# EAGLE design LEDs (EAGLE 7.7.0)
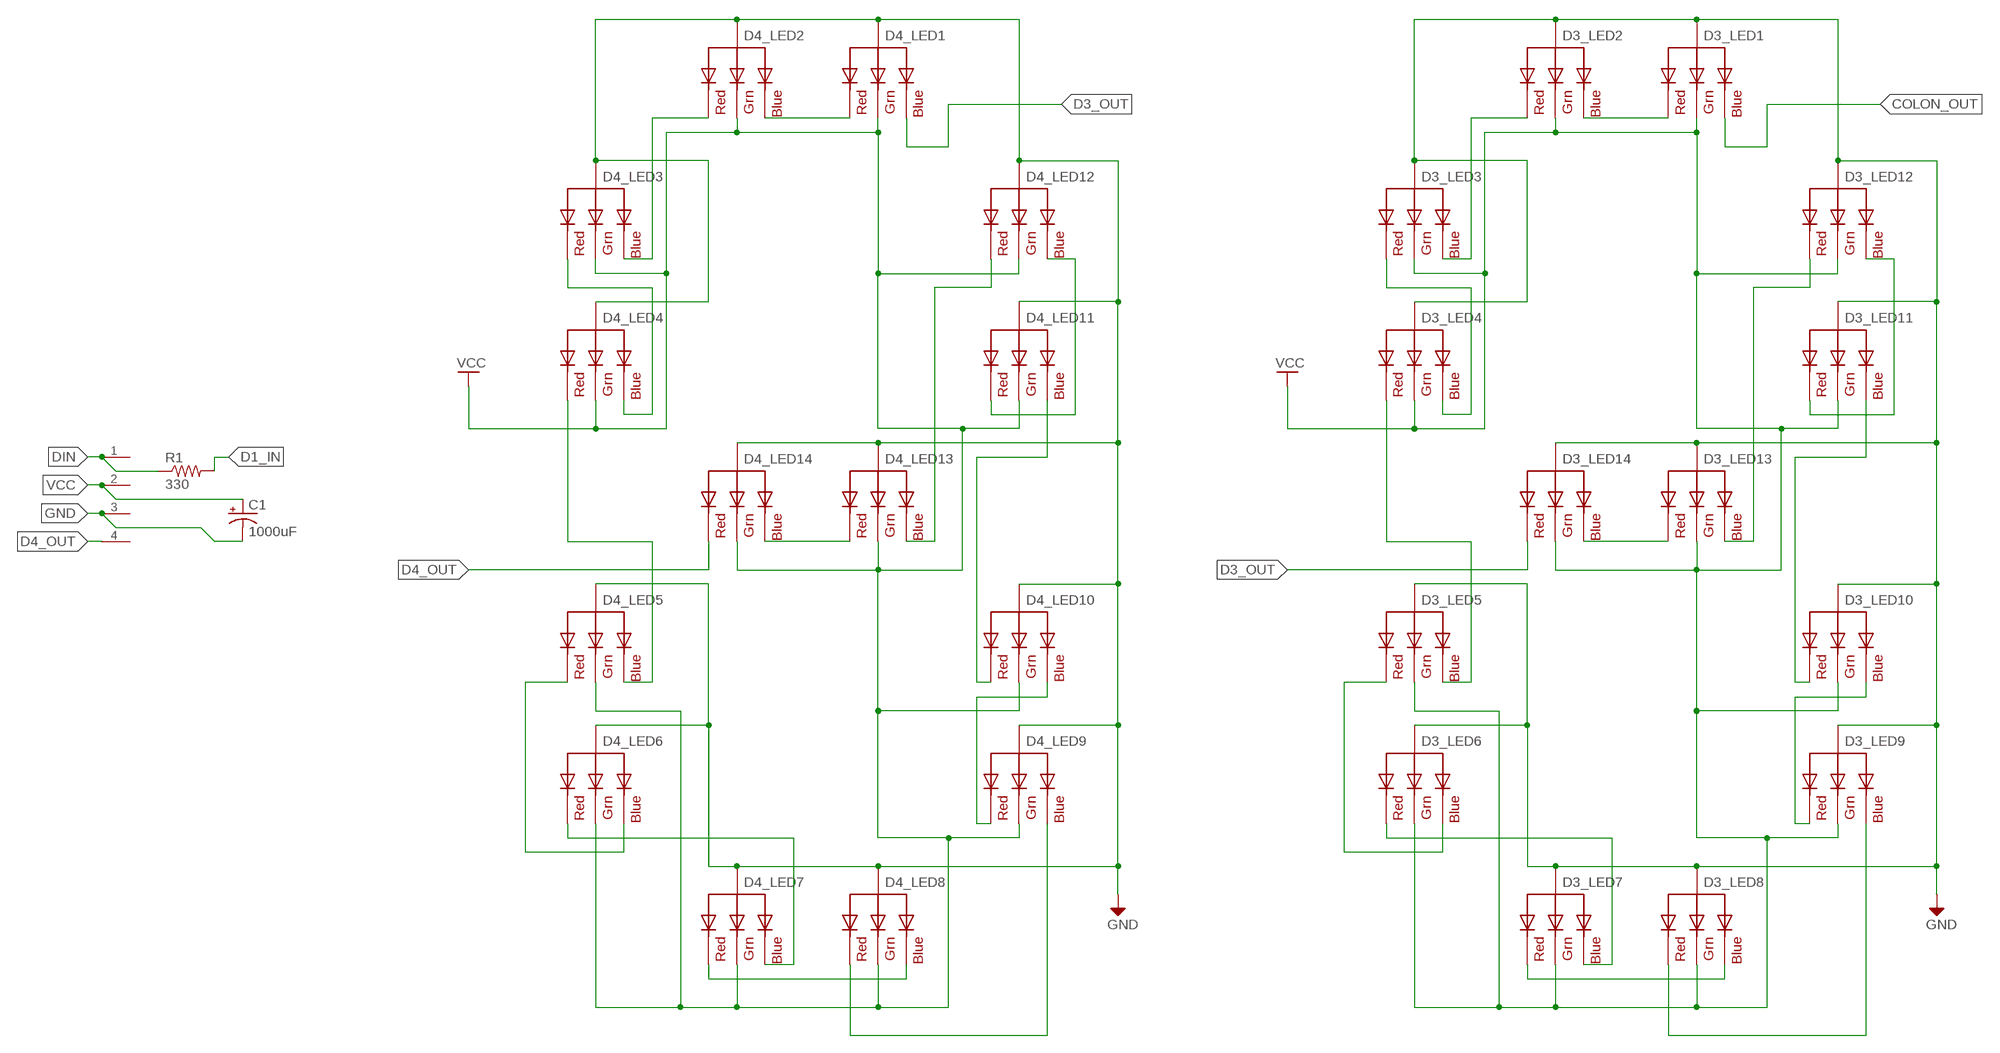
[diagram p0: schematic, sheet 1, part 1 of 2]
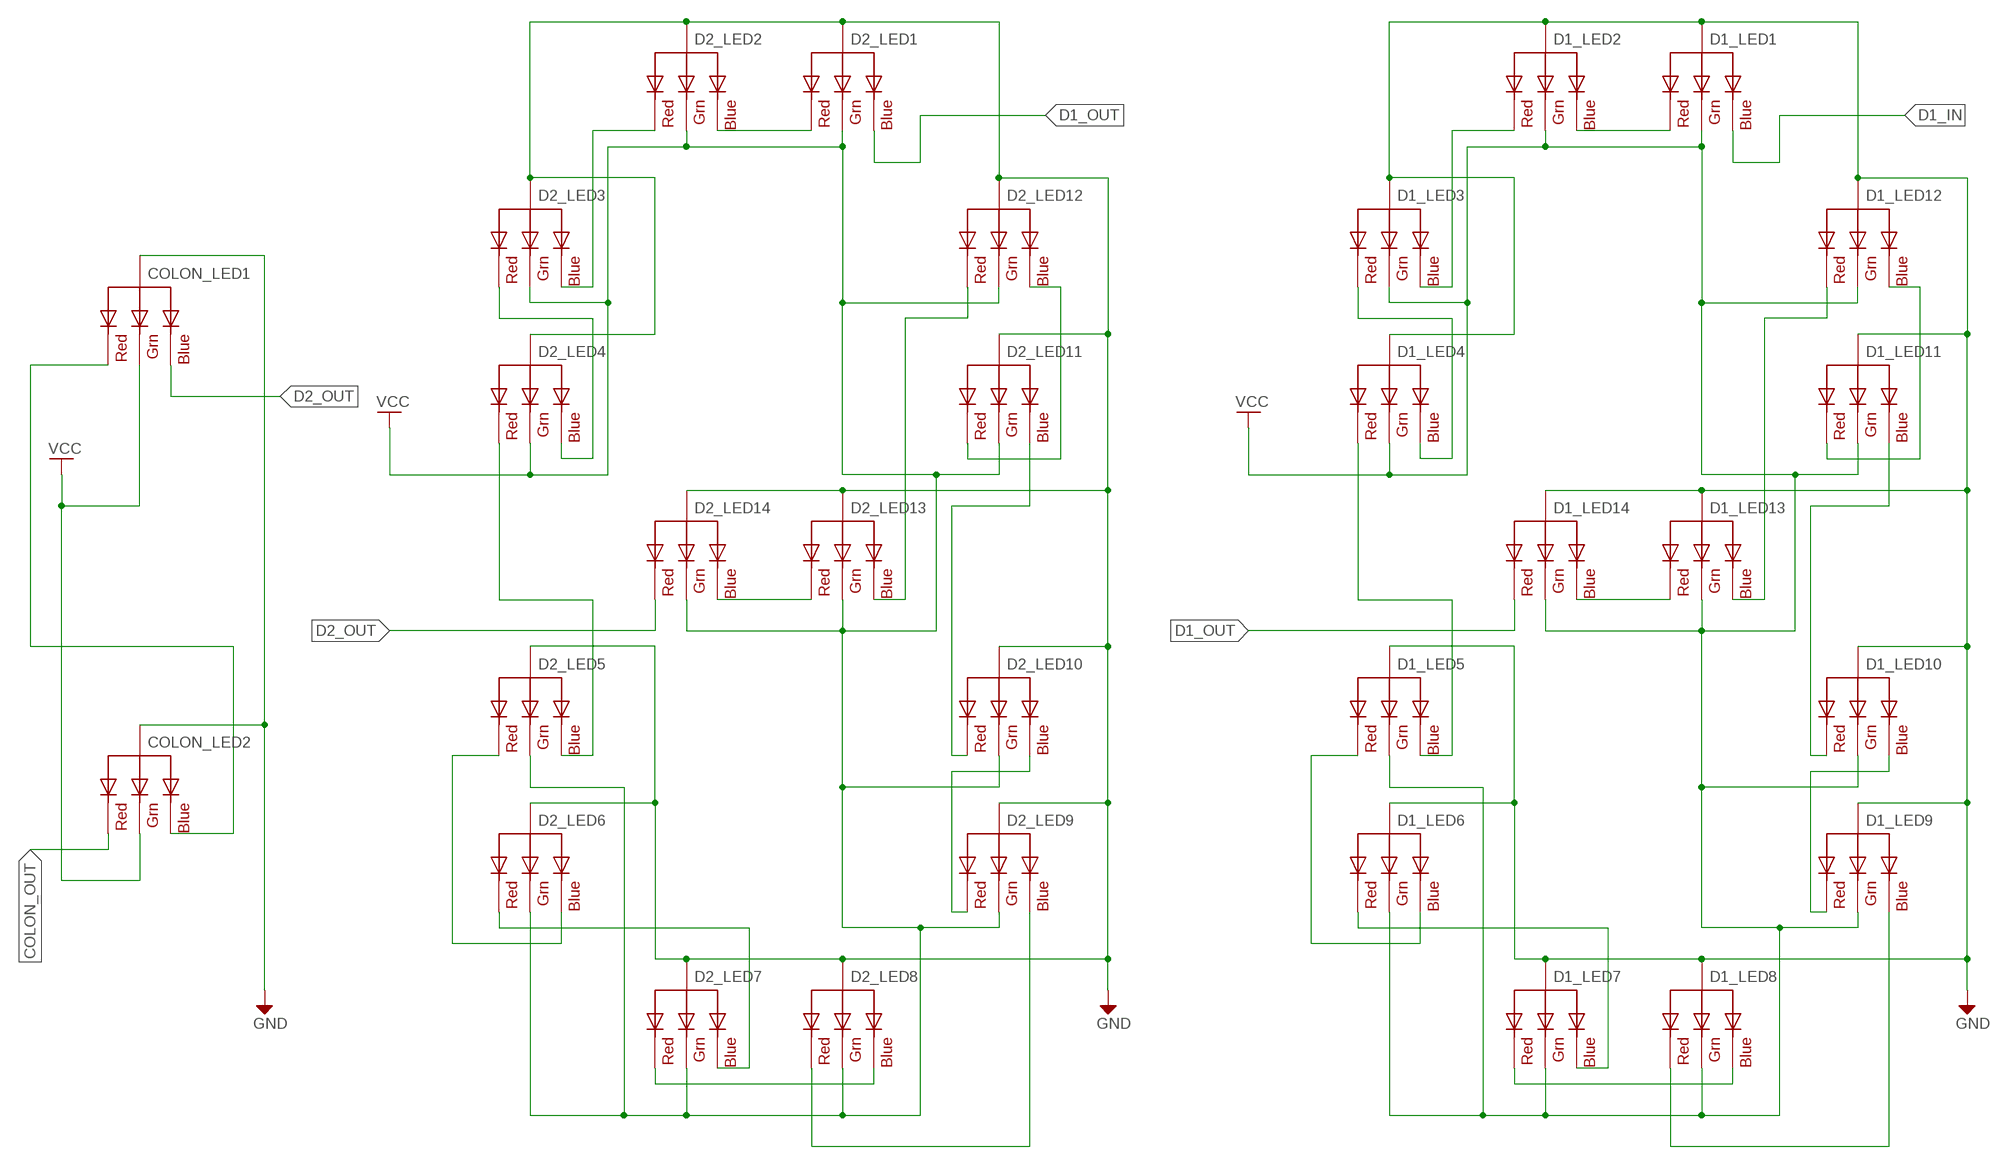
[diagram p1: schematic, sheet 1, part 2 of 2]

## Parts
C1  1000uF  CPOL-USE2.5-6  [E2,5-6]
COLON_LED1  RGBLED_CA-5MM  [LED5MMRGB]
COLON_LED2  RGBLED_CA-5MM  [LED5MMRGB]
D1_LED1  RGBLED_CA-5MM  [LED5MMRGB]
D1_LED2  RGBLED_CA-5MM  [LED5MMRGB]
D1_LED3  RGBLED_CA-5MM  [LED5MMRGB]
D1_LED4  RGBLED_CA-5MM  [LED5MMRGB]
D1_LED5  RGBLED_CA-5MM  [LED5MMRGB]
D1_LED6  RGBLED_CA-5MM  [LED5MMRGB]
D1_LED7  RGBLED_CA-5MM  [LED5MMRGB]
D1_LED8  RGBLED_CA-5MM  [LED5MMRGB]
D1_LED9  RGBLED_CA-5MM  [LED5MMRGB]
D1_LED10  RGBLED_CA-5MM  [LED5MMRGB]
D1_LED11  RGBLED_CA-5MM  [LED5MMRGB]
D1_LED12  RGBLED_CA-5MM  [LED5MMRGB]
D1_LED13  RGBLED_CA-5MM  [LED5MMRGB]
D1_LED14  RGBLED_CA-5MM  [LED5MMRGB]
D2_LED1  RGBLED_CA-5MM  [LED5MMRGB]
D2_LED2  RGBLED_CA-5MM  [LED5MMRGB]
D2_LED3  RGBLED_CA-5MM  [LED5MMRGB]
D2_LED4  RGBLED_CA-5MM  [LED5MMRGB]
D2_LED5  RGBLED_CA-5MM  [LED5MMRGB]
D2_LED6  RGBLED_CA-5MM  [LED5MMRGB]
D2_LED7  RGBLED_CA-5MM  [LED5MMRGB]
D2_LED8  RGBLED_CA-5MM  [LED5MMRGB]
D2_LED9  RGBLED_CA-5MM  [LED5MMRGB]
D2_LED10  RGBLED_CA-5MM  [LED5MMRGB]
D2_LED11  RGBLED_CA-5MM  [LED5MMRGB]
D2_LED12  RGBLED_CA-5MM  [LED5MMRGB]
D2_LED13  RGBLED_CA-5MM  [LED5MMRGB]
D2_LED14  RGBLED_CA-5MM  [LED5MMRGB]
D3_LED1  RGBLED_CA-5MM  [LED5MMRGB]
D3_LED2  RGBLED_CA-5MM  [LED5MMRGB]
D3_LED3  RGBLED_CA-5MM  [LED5MMRGB]
D3_LED4  RGBLED_CA-5MM  [LED5MMRGB]
D3_LED5  RGBLED_CA-5MM  [LED5MMRGB]
D3_LED6  RGBLED_CA-5MM  [LED5MMRGB]
D3_LED7  RGBLED_CA-5MM  [LED5MMRGB]
D3_LED8  RGBLED_CA-5MM  [LED5MMRGB]
D3_LED9  RGBLED_CA-5MM  [LED5MMRGB]
D3_LED10  RGBLED_CA-5MM  [LED5MMRGB]
D3_LED11  RGBLED_CA-5MM  [LED5MMRGB]
D3_LED12  RGBLED_CA-5MM  [LED5MMRGB]
D3_LED13  RGBLED_CA-5MM  [LED5MMRGB]
D3_LED14  RGBLED_CA-5MM  [LED5MMRGB]
D4_LED1  RGBLED_CA-5MM  [LED5MMRGB]
D4_LED2  RGBLED_CA-5MM  [LED5MMRGB]
D4_LED3  RGBLED_CA-5MM  [LED5MMRGB]
D4_LED4  RGBLED_CA-5MM  [LED5MMRGB]
D4_LED5  RGBLED_CA-5MM  [LED5MMRGB]
D4_LED6  RGBLED_CA-5MM  [LED5MMRGB]
D4_LED7  RGBLED_CA-5MM  [LED5MMRGB]
D4_LED8  RGBLED_CA-5MM  [LED5MMRGB]
D4_LED9  RGBLED_CA-5MM  [LED5MMRGB]
D4_LED10  RGBLED_CA-5MM  [LED5MMRGB]
D4_LED11  RGBLED_CA-5MM  [LED5MMRGB]
D4_LED12  RGBLED_CA-5MM  [LED5MMRGB]
D4_LED13  RGBLED_CA-5MM  [LED5MMRGB]
D4_LED14  RGBLED_CA-5MM  [LED5MMRGB]
R1  330  R-US_R0805  [R0805]
U$1  HEADER-1X4  [HEADER-1X4]

## Nets
COLON_OUT: COLON_LED2.1(RED) D3_LED1.4(BLUE)
D1_IN: D1_LED1.4(BLUE) R1.2
D1_OUT: D1_LED14.1(RED) D2_LED1.4(BLUE)
D2_OUT: COLON_LED1.4(BLUE) D2_LED14.1(RED)
D3_OUT: D3_LED14.1(RED) D4_LED1.4(BLUE)
D4_OUT: D4_LED14.1(RED) U$1.4
DIN: R1.1 U$1.1
GND: C1.- COLON_LED1.2(VCC) COLON_LED2.2(VCC) D1_LED1.2(VCC) D1_LED2.2(VCC) D1_LED3.2(VCC) D1_LED4.2(VCC) D1_LED5.2(VCC) D1_LED6.2(VCC) D1_LED7.2(VCC) D1_LED8.2(VCC) D1_LED9.2(VCC) D1_LED10.2(VCC) D1_LED11.2(VCC) D1_LED12.2(VCC) D1_LED13.2(VCC) D1_LED14.2(VCC) D2_LED1.2(VCC) D2_LED2.2(VCC) D2_LED3.2(VCC) D2_LED4.2(VCC) D2_LED5.2(VCC) D2_LED6.2(VCC) D2_LED7.2(VCC) D2_LED8.2(VCC) D2_LED9.2(VCC) D2_LED10.2(VCC) D2_LED11.2(VCC) D2_LED12.2(VCC) D2_LED13.2(VCC) D2_LED14.2(VCC) D3_LED1.2(VCC) D3_LED2.2(VCC) D3_LED3.2(VCC) D3_LED4.2(VCC) D3_LED5.2(VCC) D3_LED6.2(VCC) D3_LED7.2(VCC) D3_LED8.2(VCC) D3_LED9.2(VCC) D3_LED10.2(VCC) D3_LED11.2(VCC) D3_LED12.2(VCC) D3_LED13.2(VCC) D3_LED14.2(VCC) D4_LED1.2(VCC) D4_LED2.2(VCC) D4_LED3.2(VCC) D4_LED4.2(VCC) D4_LED5.2(VCC) D4_LED6.2(VCC) D4_LED7.2(VCC) D4_LED8.2(VCC) D4_LED9.2(VCC) D4_LED10.2(VCC) D4_LED11.2(VCC) D4_LED12.2(VCC) D4_LED13.2(VCC) D4_LED14.2(VCC) U$1.3
N$1: D1_LED1.1(RED) D1_LED2.4(BLUE)
N$2: D1_LED2.1(RED) D1_LED3.4(BLUE)
N$3: D1_LED3.1(RED) D1_LED4.4(BLUE)
N$4: D1_LED4.1(RED) D1_LED5.4(BLUE)
N$5: D1_LED5.1(RED) D1_LED6.4(BLUE)
N$6: D1_LED6.1(RED) D1_LED7.4(BLUE)
N$7: D1_LED7.1(RED) D1_LED8.4(BLUE)
N$8: D1_LED8.1(RED) D1_LED9.4(BLUE)
N$9: D1_LED9.1(RED) D1_LED10.4(BLUE)
N$10: D1_LED10.1(RED) D1_LED11.4(BLUE)
N$11: D1_LED11.1(RED) D1_LED12.4(BLUE)
N$12: D1_LED12.1(RED) D1_LED13.4(BLUE)
N$13: D1_LED13.1(RED) D1_LED14.4(BLUE)
N$14: D2_LED1.1(RED) D2_LED2.4(BLUE)
N$15: D2_LED2.1(RED) D2_LED3.4(BLUE)
N$16: D2_LED3.1(RED) D2_LED4.4(BLUE)
N$17: D2_LED4.1(RED) D2_LED5.4(BLUE)
N$18: D2_LED5.1(RED) D2_LED6.4(BLUE)
N$19: D2_LED6.1(RED) D2_LED7.4(BLUE)
N$20: D2_LED7.1(RED) D2_LED8.4(BLUE)
N$21: D2_LED8.1(RED) D2_LED9.4(BLUE)
N$22: D2_LED9.1(RED) D2_LED10.4(BLUE)
N$23: D2_LED10.1(RED) D2_LED11.4(BLUE)
N$24: D2_LED11.1(RED) D2_LED12.4(BLUE)
N$25: D2_LED12.1(RED) D2_LED13.4(BLUE)
N$26: D2_LED13.1(RED) D2_LED14.4(BLUE)
N$27: D3_LED1.1(RED) D3_LED2.4(BLUE)
N$28: D3_LED2.1(RED) D3_LED3.4(BLUE)
N$29: D3_LED3.1(RED) D3_LED4.4(BLUE)
N$30: D3_LED4.1(RED) D3_LED5.4(BLUE)
N$31: D3_LED5.1(RED) D3_LED6.4(BLUE)
N$32: D3_LED6.1(RED) D3_LED7.4(BLUE)
N$33: D3_LED7.1(RED) D3_LED8.4(BLUE)
N$34: D3_LED8.1(RED) D3_LED9.4(BLUE)
N$35: D3_LED9.1(RED) D3_LED10.4(BLUE)
N$36: D3_LED10.1(RED) D3_LED11.4(BLUE)
N$37: D3_LED11.1(RED) D3_LED12.4(BLUE)
N$38: D3_LED12.1(RED) D3_LED13.4(BLUE)
N$39: D3_LED13.1(RED) D3_LED14.4(BLUE)
N$40: D4_LED1.1(RED) D4_LED2.4(BLUE)
N$41: D4_LED2.1(RED) D4_LED3.4(BLUE)
N$42: D4_LED3.1(RED) D4_LED4.4(BLUE)
N$43: D4_LED4.1(RED) D4_LED5.4(BLUE)
N$44: D4_LED5.1(RED) D4_LED6.4(BLUE)
N$45: D4_LED6.1(RED) D4_LED7.4(BLUE)
N$46: D4_LED7.1(RED) D4_LED8.4(BLUE)
N$47: D4_LED8.1(RED) D4_LED9.4(BLUE)
N$48: D4_LED9.1(RED) D4_LED10.4(BLUE)
N$49: D4_LED10.1(RED) D4_LED11.4(BLUE)
N$50: D4_LED11.1(RED) D4_LED12.4(BLUE)
N$51: D4_LED12.1(RED) D4_LED13.4(BLUE)
N$52: D4_LED13.1(RED) D4_LED14.4(BLUE)
N$53: COLON_LED1.1(RED) COLON_LED2.4(BLUE)
VCC: C1.+ COLON_LED1.3(GREEN) COLON_LED2.3(GREEN) D1_LED1.3(GREEN) D1_LED2.3(GREEN) D1_LED3.3(GREEN) D1_LED4.3(GREEN) D1_LED5.3(GREEN) D1_LED6.3(GREEN) D1_LED7.3(GREEN) D1_LED8.3(GREEN) D1_LED9.3(GREEN) D1_LED10.3(GREEN) D1_LED11.3(GREEN) D1_LED12.3(GREEN) D1_LED13.3(GREEN) D1_LED14.3(GREEN) D2_LED1.3(GREEN) D2_LED2.3(GREEN) D2_LED3.3(GREEN) D2_LED4.3(GREEN) D2_LED5.3(GREEN) D2_LED6.3(GREEN) D2_LED7.3(GREEN) D2_LED8.3(GREEN) D2_LED9.3(GREEN) D2_LED10.3(GREEN) D2_LED11.3(GREEN) D2_LED12.3(GREEN) D2_LED13.3(GREEN) D2_LED14.3(GREEN) D3_LED1.3(GREEN) D3_LED2.3(GREEN) D3_LED3.3(GREEN) D3_LED4.3(GREEN) D3_LED5.3(GREEN) D3_LED6.3(GREEN) D3_LED7.3(GREEN) D3_LED8.3(GREEN) D3_LED9.3(GREEN) D3_LED10.3(GREEN) D3_LED11.3(GREEN) D3_LED12.3(GREEN) D3_LED13.3(GREEN) D3_LED14.3(GREEN) D4_LED1.3(GREEN) D4_LED2.3(GREEN) D4_LED3.3(GREEN) D4_LED4.3(GREEN) D4_LED5.3(GREEN) D4_LED6.3(GREEN) D4_LED7.3(GREEN) D4_LED8.3(GREEN) D4_LED9.3(GREEN) D4_LED10.3(GREEN) D4_LED11.3(GREEN) D4_LED12.3(GREEN) D4_LED13.3(GREEN) D4_LED14.3(GREEN) U$1.2

## Library data of the parts
C1 = adafruit:CPOL-US: POLARIZED CAPACITOR, American symbol
COLON_LED1 COLON_LED2 D1_LED1-D1_LED14 D2_LED1-D2_LED14 D3_LED1-D3_LED14 D4_LED1-D4_LED14 = adafruit:RGBLED_CA: RGB LED, common-anode 5MM Staggered pins 5mm Piranha package http://www.ladyada.net/library/pcb/eaglelibrary.html
R1 = adafruit:R-US_: RESISTOR, American symbol
U$1 = teelsys-0.2:HEADER-1X4

## Board
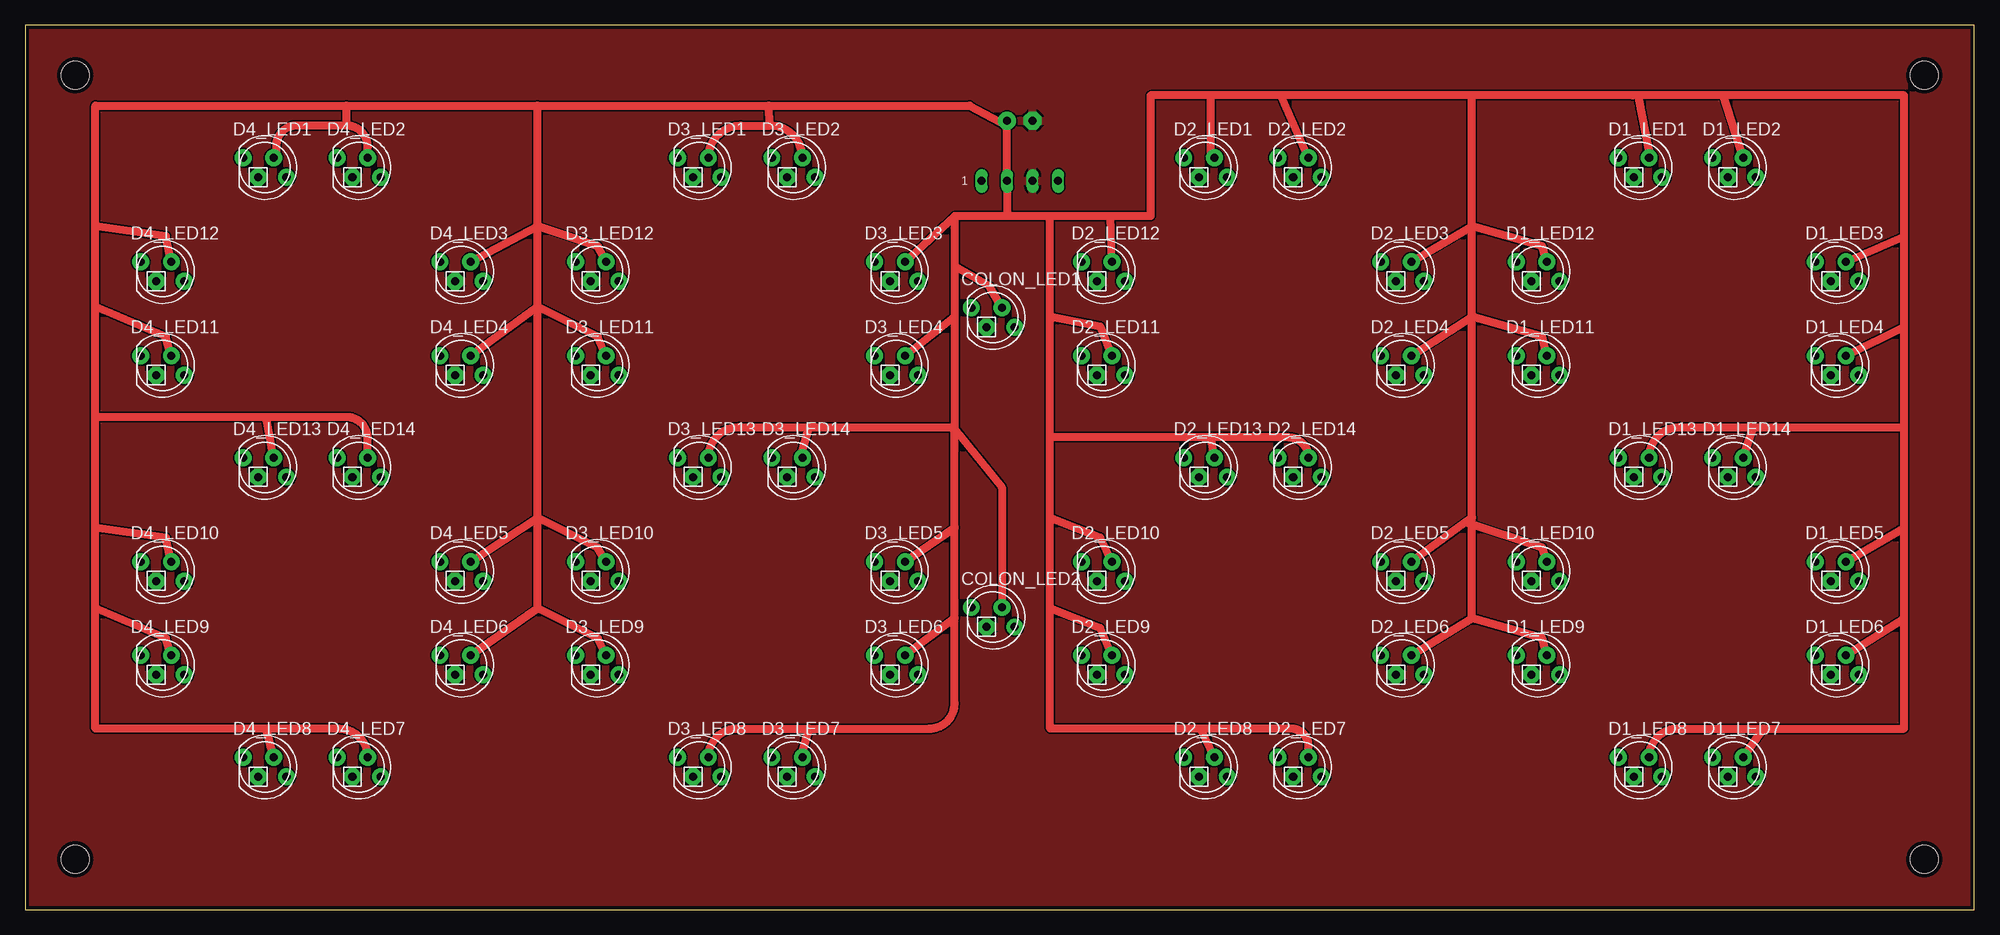
[diagram p2: board, top side]
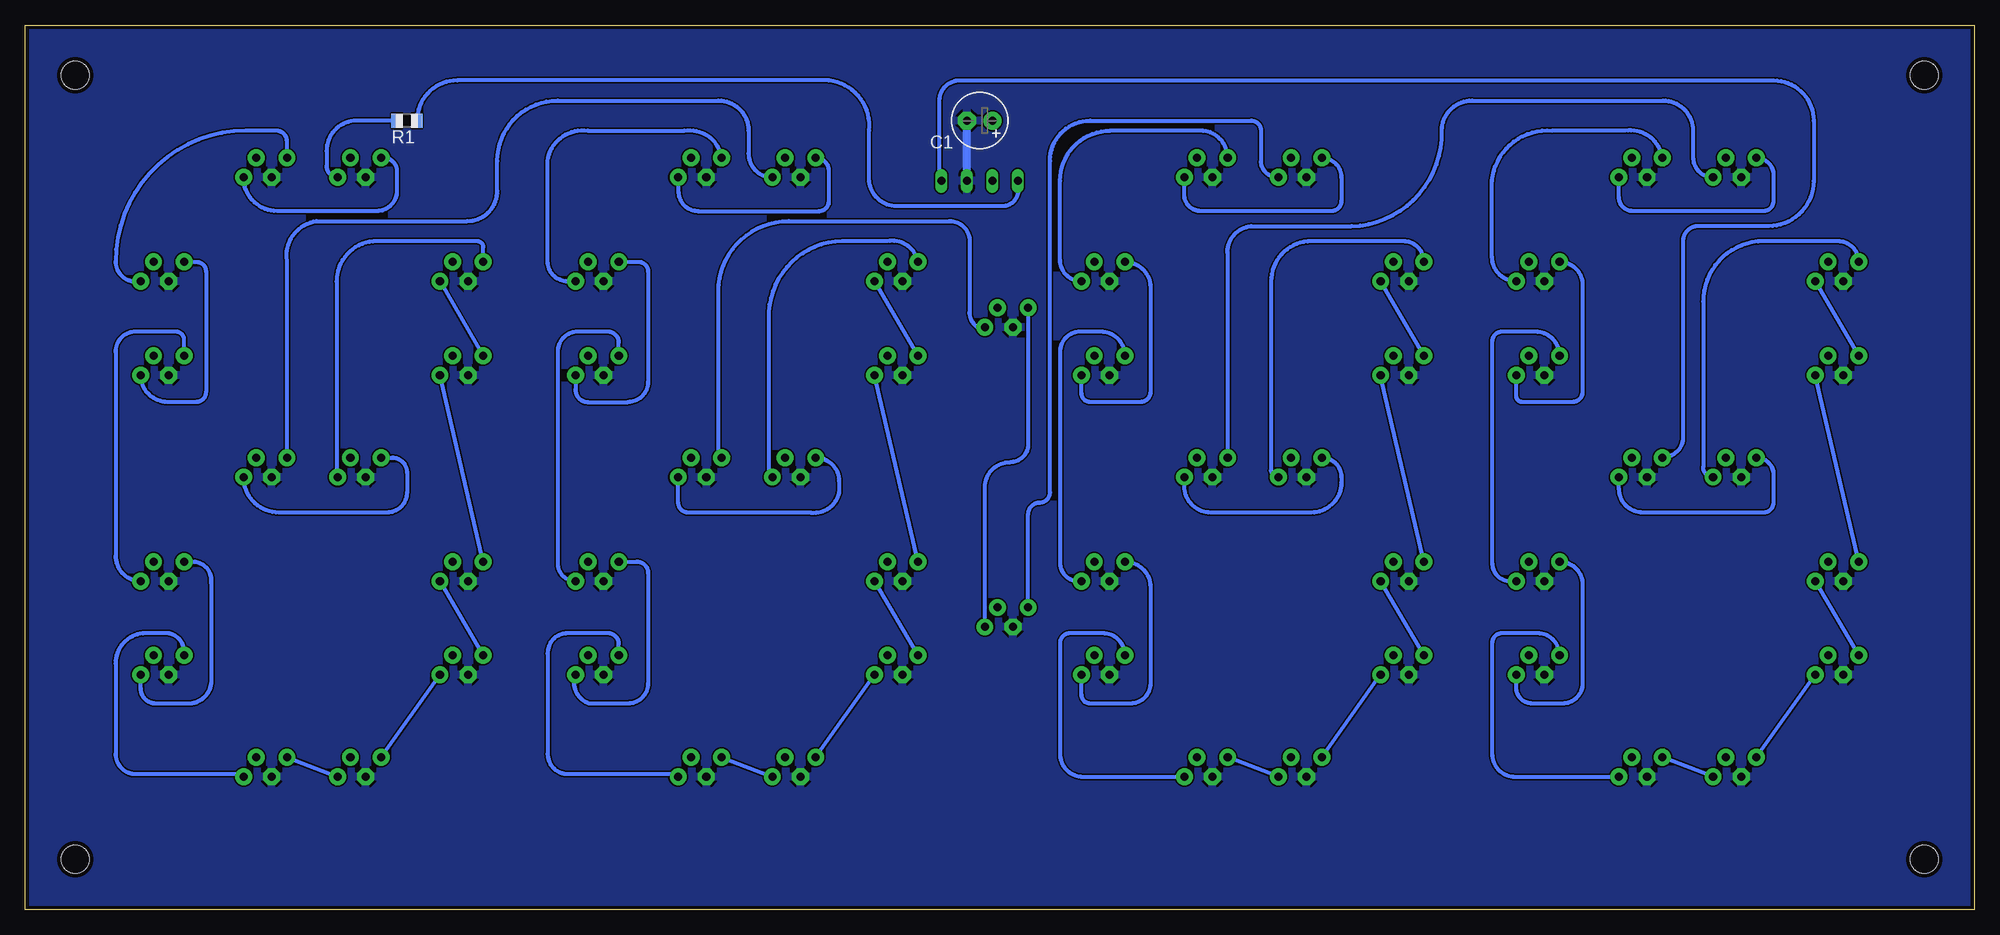
[diagram p3: board, bottom side, seen from below]

Size 194 x 88 mm. Coordinates in mm from the lower left corner, seen from the top.
Outline: 0,0 194,0 194,88 0,88 0,0
Copper layers (1*16): Top 0.035559375mm / dielectric 1.6mm / Bottom 0.035559375mm
Design rules "oshpark-2layer2020": minimum track width 6mil, minimum drill 10mil, track to track 6mil, track to pad 6mil, pad to pad 6mil, via to via 6mil, smd to smd 6mil, copper to edge 15mil, drill to drill 6mil, minimum pad ring 5mil, minimum via ring 5mil, stop-mask expansion 2.5mil, vias tented up to drill 0mil, thermal gap 10mil
Holes 2.8 mm at 5,83 5,5 189,5 189,83

### Footprints (pad centres in the part's own frame; a part is rotated, then mirrored left to right if it is on the bottom)
E2,5-6 = drill 0.813 pad 1.778: + -1.27,0 | drill 0.813 pad 1.778 octagon: - 1.27,0
LED5MMRGB = drill 0.8 pad 1.676: 1 -2.159,0.968; 3 0.889,0.968; 4 2.159,-0.968 | drill 0.8 pad 1.676 octagon: 2 -0.635,-0.968
R0805 = smd 1.1 x 1.4: 1 -1,0; 2 1,0
HEADER-1X4 = drill 0.8 long: 1 0,3.81; 2 0,1.27; 3 0,-1.27; 4 0,-3.81

### Placement (x,y rotation side)
C1  99,78.5 180 bottom
COLON_LED1  96.33,58.91 0 top
COLON_LED2  96.33,29.09 0 top
D1_LED1  160.74,73.82 0 top
D1_LED2  170.1,73.82 0 top
D1_LED3  180.33,63.47 0 top
D1_LED4  180.33,54.14 0 top
D1_LED5  180.33,33.65 0 top
D1_LED6  180.33,24.32 0 top
D1_LED7  170.1,14.18 0 top
D1_LED8  160.74,14.18 0 top
D1_LED9  150.56,24.32 0 top
D1_LED10  150.56,33.65 0 top
D1_LED11  150.56,54.14 0 top
D1_LED12  150.56,63.47 0 top
D1_LED13  160.74,44 0 top
D1_LED14  170.1,44 0 top
D2_LED1  117.47,73.82 0 top
D2_LED2  126.84,73.82 0 top
D2_LED3  137.07,63.47 0 top
D2_LED4  137.07,54.14 0 top
D2_LED5  137.07,33.65 0 top
D2_LED6  137.07,24.32 0 top
D2_LED7  126.84,14.18 0 top
D2_LED8  117.47,14.18 0 top
D2_LED9  107.3,24.32 0 top
D2_LED10  107.3,33.65 0 top
D2_LED11  107.3,54.14 0 top
D2_LED12  107.3,63.47 0 top
D2_LED13  117.47,44 0 top
D2_LED14  126.84,44 0 top
D3_LED1  67.11,73.82 0 top
D3_LED2  76.47,73.82 0 top
D3_LED3  86.7,63.47 0 top
D3_LED4  86.7,54.14 0 top
D3_LED5  86.7,33.65 0 top
D3_LED6  86.7,24.32 0 top
D3_LED7  76.47,14.18 0 top
D3_LED8  67.11,14.18 0 top
D3_LED9  56.93,24.32 0 top
D3_LED10  56.93,33.65 0 top
D3_LED11  56.93,54.14 0 top
D3_LED12  56.93,63.47 0 top
D3_LED13  67.11,44 0 top
D3_LED14  76.47,44 0 top
D4_LED1  23.85,73.82 0 top
D4_LED2  33.21,73.82 0 top
D4_LED3  43.44,63.47 0 top
D4_LED4  43.44,54.14 0 top
D4_LED5  43.44,33.65 0 top
D4_LED6  43.44,24.32 0 top
D4_LED7  33.21,14.18 0 top
D4_LED8  23.85,14.18 0 top
D4_LED9  13.67,24.32 0 top
D4_LED10  13.67,33.65 0 top
D4_LED11  13.67,54.14 0 top
D4_LED12  13.67,63.47 0 top
D4_LED13  23.85,44 0 top
D4_LED14  33.21,44 0 top
R1  156,78.5 180 bottom
U$1  99,72.5 90 top

### Tracks (layer width: path | path; a pad name or v marks a point on that pad's centre or on a via)
COLON_OUT
  Bottom 0.406: COLON_LED2.1 94.17,39.33 arc90 93,40.5 arc-90 92,41.5 92,74.5 arc90 88,78.5 72,78.5 arc90 71,77.5 71,74.5 arc-90 69.36,72.86 D3_LED1.4
D1_IN
  Bottom 0.406: R1.2 161,78.5 arc-90 164,75.5 164,73.96 arc-90 D1_LED1.4
D1_OUT
  Bottom 0.406: D1_LED14.1 167.94,64.56 arc90 165,68.5 150,68.5 arc-90 147,71.5 147,74.5 arc90 141,80.5 125,80.5 arc90 122,77.5 122,75.22 arc-90 D2_LED1.4
D2_OUT
  Bottom 0.406: D2_LED14.1 arc90 125,45.29 125,61.5 arc90 118,68.5 102,68.5 arc90 100,66.5 100,59.5 arc-90 98,57.5 98.04,57.5 arc90 COLON_LED1.4
D3_OUT
  Bottom 0.406: D3_LED14.1 74.31,65.19 arc90 72,68 62,68 arc-90 53,77.5 arc90 50,80.5 31,80.5 arc90 28,77.5 28,74.85 arc-90 D4_LED1.4
D4_OUT
  Bottom 0.406: U$1.4 arc90 103,72.69 103,80.5 arc90 101,82.5 20,82.5 arc90 16,78.5 16,72.5 arc90 20.5,68 27.5,68 arc-90 29,66.5 29,47.02 arc90 D4_LED14.1
DIN
  Bottom 0.406: R1.1 arc90 151,82.5 114,82.5 arc90 110,77.5 110,72.5 arc-90 107,70 97,70 arc-90 95.19,71.31 U$1.1
GND
  Bottom 0.813: U$1.3 C1.-
  pour Bottom: 0,0 194,0 194,88 0,88
  pour Top: 0,0 194,0 194,88 0,88
N$1
  Bottom 0.406: D1_LED1.1 158.29,74.79 arc90 157,73.5 157,71.5 arc90 159,69.5 168.9,69.5 arc90 D1_LED2.4
N$2
  Bottom 0.406: D1_LED2.1 167.94,76.44 arc-90 169,77.5 172,77.5 arc-90 185,64.5 arc-90 183,62.5 D1_LED3.4 arc-90 D1_LED3.4
N$3
  Bottom 0.406: D1_LED3.1 176.94,64.44 arc90 176,63.5 176,51.5 arc90 177,50.5 179.81,50.5 arc90 D1_LED4.4
N$4
  Bottom 0.406: D1_LED4.1 178.17,56.67 arc-90 179,57.5 183,57.5 arc-90 185,55.5 185,35.19 arc-90 D1_LED5.4
N$5
  Bottom 0.406: D1_LED5.1 177.12,34.62 arc90 175.5,32.5 175.5,22.5 arc90 178,20.5 181,20.5 arc90 182.49,21.99 D1_LED6.4
N$6
  Bottom 0.406: D1_LED6.1 178.17,25.67 arc-90 180,27.5 182,27.5 arc-90 185,24.5 185,15.5 arc-90 183,13.5 172.55,13.5 arc90 D1_LED7.4
N$7
  Bottom 0.406: D1_LED7.1 D1_LED8.4
N$8
  Bottom 0.406: D1_LED8.1 D1_LED9.4
N$9
  Bottom 0.406: D1_LED9.1 D1_LED10.4
N$10
  Bottom 0.406: D1_LED10.1 D1_LED11.4
N$11
  Bottom 0.406: D1_LED11.1 D1_LED12.4
N$12
  Bottom 0.406: D1_LED12.1 148.4,65.9 arc-90 149,66.5 159,66.5 arc-90 163,62.5 163,43.14 arc-90 D1_LED13.4
N$13
  Bottom 0.406: D1_LED13.1 157.47,44.97 arc90 156,43.5 156,41.5 arc90 158,39.5 168.73,39.5 arc90 D1_LED14.4
N$14
  Bottom 0.406: D2_LED2.4 129,71.5 arc-90 127,69.5 115,69.5 arc-90 114,70.5 114,73.48 arc-90 D2_LED1.1
N$15
  Bottom 0.406: D2_LED3.4 140.01,62.51 arc90 142,64.5 142,74.5 arc90 138,77.5 128.39,77.5 arc90 D2_LED2.1
N$16
  Bottom 0.406: D2_LED3.1 132.94,64.44 arc90 132,63.5 132,52.5 arc90 134,50.5 138,50.5 arc90 139.23,51.73 D2_LED4.4
N$17
  Bottom 0.406: D2_LED4.1 134.91,56.41 arc-90 136,57.5 139,57.5 arc-90 141,55.5 141,34.45 arc-90 D2_LED5.4
N$18
  Bottom 0.406: D2_LED5.1 133.12,34.62 arc90 132,33.5 132,22.5 arc90 134,20.5 137.88,20.5 arc90 D2_LED6.4
N$19
  Bottom 0.406: D2_LED6.1 134.91,26.41 arc-90 136,27.5 140,27.5 arc-90 142,25.5 142,15.5 arc-90 140,13.5 129.29,13.5 arc90 D2_LED7.4
N$20
  Bottom 0.406: D2_LED7.1 D2_LED8.4
N$21
  Bottom 0.406: D2_LED8.1 D2_LED9.4
N$22
  Bottom 0.406: D2_LED9.1 D2_LED10.4
N$23
  Bottom 0.406: D2_LED10.1 D2_LED11.4
N$24
  Bottom 0.406: D2_LED11.1 D2_LED12.4
N$25
  Bottom 0.406: D2_LED12.1 arc-90 108.2,66.5 112,66.5 arc-90 120,59.5 120,42.5 arc-90 119.63,42.87 D2_LED13.4
N$26
  Bottom 0.406: D2_LED13.1 arc90 113,42.66 113,41.5 arc90 116,39.5 128,39.5 arc90 129,40.5 D2_LED14.4
N$27
  Bottom 0.406: D3_LED1.1 arc90 63,72.84 63,70.5 arc90 64,69.5 77,69.5 arc90 78.63,71.13 D3_LED2.4
N$28
  Bottom 0.406: D3_LED2.1 arc-90 77.02,77.5 86,77.5 arc-90 91,72.5 91,64.64 arc-90 D3_LED3.4
N$29
  Bottom 0.406: D3_LED3.1 arc90 82,61.9 82,51.5 arc90 83,50.5 88,50.5 arc90 88.86,51.36 D3_LED4.4
N$30
  Bottom 0.406: D3_LED4.1 arc-90 86.93,57.5 89,57.5 arc-90 91,55.5 91,34.5 arc-90 89.18,32.68 D3_LED5.4
N$31
  Bottom 0.406: D3_LED5.1 arc90 82,32.07 82,22.5 arc90 84,20.5 88,20.5 arc90 88.86,21.36 D3_LED6.4
N$32
  Bottom 0.406: D3_LED6.1 arc-90 86.76,27.5 90,27.5 arc-90 91,26.5 91,15.5 arc-90 88.71,13.21 D3_LED7.4
N$33
  Bottom 0.406: D3_LED8.4 D3_LED7.1
N$34
  Bottom 0.406: D3_LED8.1 D3_LED9.4
N$35
  Bottom 0.406: D3_LED9.1 D3_LED10.4
N$36
  Bottom 0.406: D3_LED10.1 D3_LED11.4
N$37
  Bottom 0.406: D3_LED11.1 D3_LED12.4
N$38
  Bottom 0.406: D3_LED12.1 arc-90 56.83,66.5 66,66.5 arc-90 70,62.5 70,43.77 arc-90 D3_LED13.4
N$39
  Bottom 0.406: D3_LED13.1 arc90 63,43.02 63,42.5 arc90 66,39.5 76,39.5 arc90 78.63,42.13 D3_LED14.4
N$40
  Bottom 0.406: D4_LED1.1 arc90 20,73.1 20,70.5 arc90 21,69.5 34,69.5 arc90 35.37,70.87 D4_LED2.4
N$41
  Bottom 0.406: D4_LED2.1 arc-90 34.76,77.5 42,77.5 arc-90 48,72.5 48,64.91 arc-90 D4_LED3.4
N$42
  Bottom 0.406: D4_LED3.1 arc90 39,62.16 39,51.5 arc90 40,50.5 45,50.5 arc90 45.6,51.1 D4_LED4.4
N$43
  Bottom 0.406: D4_LED4.1 arc-90 43.67,57.5 47,57.5 arc-90 48,56.5 48,34.5 arc-90 46.18,32.68 D4_LED5.4
N$44
  Bottom 0.406: D4_LED5.1 arc90 39,32.34 39,22.5 arc90 41,20.5 44,20.5 arc90 45.6,22.1 D4_LED6.4
N$45
  Bottom 0.406: D4_LED6.1 arc-90 43.49,27.5 47,27.5 arc-90 48,26.5 48,15.5 arc-90 45.71,13.21 D4_LED7.4
N$46
  Bottom 0.406: D4_LED8.4 D4_LED7.1
N$47
  Bottom 0.406: D4_LED8.1 D4_LED9.4
N$48
  Bottom 0.406: D4_LED9.1 D4_LED10.4
N$49
  Bottom 0.406: D4_LED10.1 D4_LED11.4
N$50
  Bottom 0.406: D4_LED11.1 D4_LED12.4
N$51
  Bottom 0.406: D4_LED12.1 arc-90 13.57,66.5 21,66.5 arc-90 27,60.5 27,44.03 arc-90 D4_LED13.4
N$52
  Bottom 0.406: D4_LED13.1 arc90 20,43.28 20,40.5 arc90 21,39.5 33,39.5 arc90 35.37,41.87 D4_LED14.4
N$53
  Bottom 0.406: COLON_LED1.1 94.17,46.33 arc90 96,44.5 arc-90 98.48,42.02 COLON_LED2.4
VCC
  Top 0.406: 77.36,45.64 D3_LED14.3 | 170.99,45.01 D1_LED14.3 | D2_LED1.3 118,75 | 160.64,80.52 160,81
  Top 0.813: 32,78 27,78 arc90 25,76 25,75.06 arc-90 D4_LED1.3 | D4_LED7.3 arc90 31.25,18 24,18 | D4_LED14.3 34.1,46.9 arc90 32,49 24,49 | D3_LED8.3 arc-90 70.85,18 78,18 | D3_LED7.3 77.36,15.64 78,18 | D3_LED13.3 arc-90 71.03,48 78,48 | D3_LED1.3 arc-90 71.21,78 74.15,78 | D2_LED14.3 arc90 125.69,47 118,47 | D2_LED7.3 127.73,16.27 arc90 126,18 117,18 | D1_LED1.3 161.62,75.62 160.64,80.52 | D1_LED13.3 arc-90 164.66,48 172,48 | D1_LED8.3 arc-90 164.48,18 173,18 | COLON_LED2.3 97.22,42 92.5,47.83 | 92.5,59 92.5,48 | 92.5,29 92.5,20.5 arc-90 90,18 78,18 | 92.5,29 92.5,38 | 92.5,38 92.5,47.83 | 92.5,48 92.5,47.83 | 78,48 92.5,48 | 77.36,45.64 78,48 | 97.73,69 U$1.2 97.73,78 | 97.73,69 92.5,69 | 92.5,69 92.5,64 | 92.5,64 92.5,59 | 97.73,78 C1.+ | 32,78 32,80 | 32,80 51,80 | 51,80 74,80 | 74,80 94,80 97.73,78 | D4_LED2.3 34.1,75.9 arc90 32,78 | 74.15,78 74,80 | D3_LED2.3 arc90 74.15,78 | 51,30 51,39 | 51,39 51,60 | 51,60 51,68 | 51,68 51,80 | 7,49 7,60 | 7,60 7,68 | 7,68 7,80 32,80 | 24,18 7,18 7,30 | 7,30 7,38 | 7,38 7,49 | D4_LED8.3 24,18 | 24,49 7,49 | D4_LED13.3 24,49 | 118,81 112,81 112,69 108,69 | 108,69 102,69 | 102,69 97.73,69 | 118,75 118,81 | 102,30 102,18 117,18 | 102,30 102,39 | 102,39 102,47 | 102,47 102,59 | 102,59 102,69 | D2_LED8.3 117,18 | 118,47 102,47 | D2_LED13.3 118,47 | 144,81 160,81 169,81 | 144,81 125,81 | 125,81 118,81 | 187,29 187,18 173,18 | 187,29 187,38 | 187,38 187,48 | 187,48 187,58 | 187,58 187,67 | 187,67 187,81 169,81 | D1_LED2.3 169,81 | 172,48 187,48 | 170.99,45.01 172,48 | D1_LED7.3 173,18 | 144,29 144,39 | 144,39 144,59 | 144,59 144,68 | 144,68 144,81 | COLON_LED1.3 96,62 92.5,64 | D3_LED4.3 92.5,59 | D3_LED3.3 92.5,69 | D3_LED6.3 92.5,29 | D3_LED5.3 92.5,38 | D4_LED11.3 14,57 7,60 | D4_LED12.3 14,67 7,68
  Top 0.813: D4_LED9.3 14,27 7,30 | D4_LED10.3 14,37 7,38 | D4_LED3.3 51,68 | D3_LED12.3 57,66 51,68 | D4_LED4.3 51,60 | D3_LED11.3 57,57 51,60 | D4_LED5.3 51,39 | D4_LED6.3 51,30 | D3_LED9.3 57,27 51,30 | D3_LED10.3 57,36 51,39 | D2_LED9.3 107,28 102,30 | D2_LED10.3 107,37 102,39 | D2_LED12.3 108,69 | D2_LED11.3 107,58 102,59 | D2_LED2.3 125,81 | D2_LED3.3 144,68 | D2_LED4.3 144,59 | D2_LED5.3 143.34,38.52 | 143.34,38.52 144,39 | D2_LED6.3 144,29 | D1_LED9.3 151,27 144,29 | D1_LED10.3 151,36 143.34,38.52 | D1_LED11.3 151,57 144,59 | D1_LED12.3 151,66 144,68 | D1_LED4.3 187,58 | D1_LED3.3 187,67 | D1_LED5.3 187,38 | D1_LED6.3 187,29